# Altium schematic sheet schematic.SchDoc
size A4; SheetNumber: 1; SheetTotal: 1
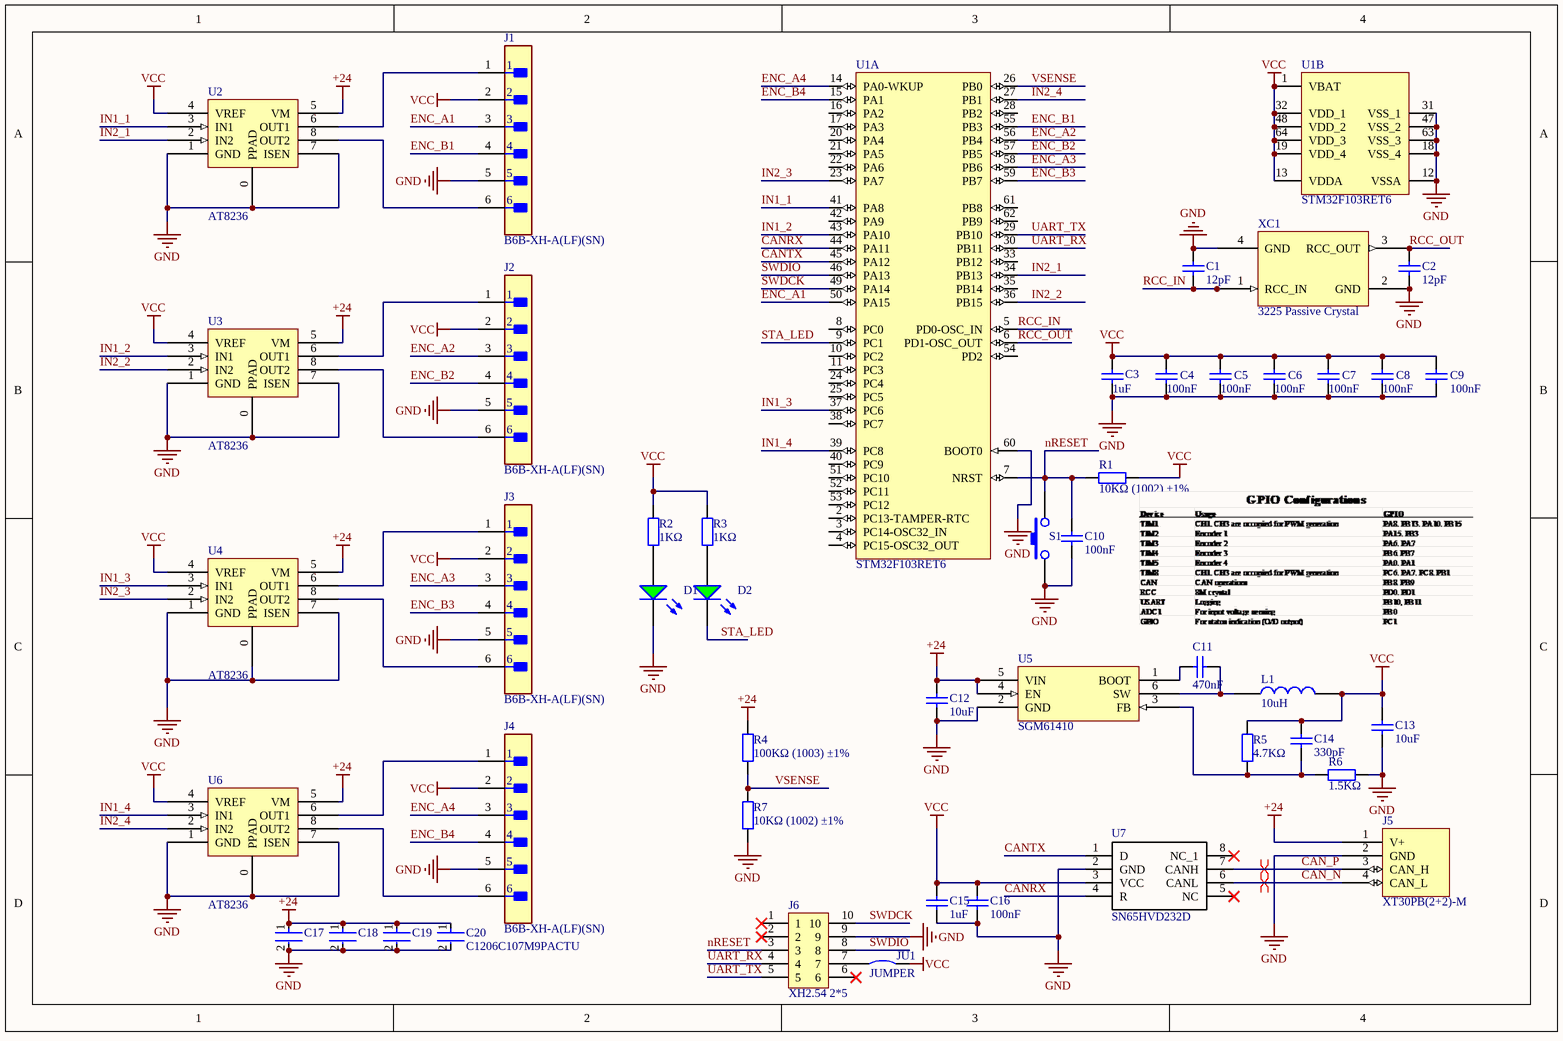
[diagram p0: schematic.SchDoc]

## Parts
C1  12pF  [0603_C]
C2  12pF  [0603_C]
C3  1uF  [0603_C]
C4  100nF  [0603_C]
C5  100nF  [0603_C]
C6  100nF  [0603_C]
C7  100nF  [0603_C]
C8  100nF  [0603_C]
C9  100nF  [0603_C]
C10  100nF  [0603_C]
C11  Capacitance: 470nF  [0603_C]  (hidden comment: 470nF (474) 10% 25V)
C12  10uF  [1206_C]
C13  10uF  [1206_C]
C14  330pF  [0603_C]
C15  1uF  [0603_C]
C16  100nF  [0603_C]
C17  C1206C107M9PACTU  [FP-C1206C-EH-MFG]  (value not drawn)
C18  C1206C107M9PACTU  [FP-C1206C-EH-MFG]  (value not drawn)
C19  C1206C107M9PACTU  [FP-C1206C-EH-MFG]  (value not drawn)
C20  C1206C107M9PACTU  [FP-C1206C-EH-MFG]
D1  绿灯 0603  [0603_LED_S1]  (value not drawn)
D2  绿灯 0603  [0603_LED_S1]  (value not drawn)
J1  B6B-XH-A(LF)(SN)  [FP-B6B-XH-A_LF_SN-MFG]
J2  B6B-XH-A(LF)(SN)  [FP-B6B-XH-A_LF_SN-MFG]
J3  B6B-XH-A(LF)(SN)  [FP-B6B-XH-A_LF_SN-MFG]
J4  B6B-XH-A(LF)(SN)  [FP-B6B-XH-A_LF_SN-MFG]
J5  XT30PB(2+2)-M  [XT30PB(2+2)-M-Footprint-1]
J6  XH2.54 2*5  [XH2.54-5x2]
JU1  JUMPER  [Jumper-2.54mm]
L1  10uH  [IND-2520X10N]
R1  10KΩ (1002) ±1%  [0603_R]
R2  1KΩ  [0603_R]
R3  1KΩ  [0603_R]
R4  100KΩ (1003) ±1%  [0603_R]
R5  4.7KΩ  [0603_R]
R6  1.5KΩ  [0603_R]
R7  10KΩ (1002) ±1%  [0603_R]
S1  按键  [SWT3*4]  (value not drawn)
U1  STM32F103RET6  [STM-LQFP64_V]  (parts A,B of 2)
U2  AT8236  [SOP-8_EP_150mil]
U3  AT8236  [SOP-8_EP_150mil]
U4  AT8236  [SOP-8_EP_150mil]
U5  SGM61410  [SOT23-6]
U6  AT8236  [SOP-8_EP_150mil]
U7  SN65HVD232D  [SOIC127P600X175-8N]
XC1  3225 Passive Crystal  [SMD-3225]

## Nets
+24: C12.2 C17.1 C18.1 C19.1 C20.1 J5.1(V+) R4.2 U2.5(VM) U3.5(VM) U4.5(VM) U5.4(EN) U5.5(VIN) U6.5(VM)
GND: C1.2 C2.1 C3.1 C4.1 C5.1 C6.1 C7.1 C8.1 C9.1 C10.1 C12.1 C13.1 C15.1 C16.1 C17.2 C18.2 C19.2 C20.2 D1.K J1.5 J2.5 J3.5 J4.5 J5.2(GND) J6.9 R6.1 R7.1 S1.1 U1.12(VSSA) U1.18(VSS_4) U1.31(VSS_1) U1.47(VSS_2) U1.60(BOOT0) U1.63(VSS_3) U2.0(PPAD) U2.1(GND) U2.7(ISEN) U3.0(PPAD) U3.1(GND) U3.7(ISEN) U4.0(PPAD) U4.1(GND) U4.7(ISEN) U5.2(GND) U6.0(PPAD) U6.1(GND) U6.7(ISEN) U7.2(GND) XC1.2(GND) XC1.4(GND)
VCC: C3.2 C4.2 C5.2 C6.2 C7.2 C8.2 C9.2 C13.2 C14.2 C15.2 C16.2 J1.2 J2.2 J3.2 J4.2 JU1.2 L1.2 R1.2 R2.2 R3.2 R5.2 U1.1(VBAT) U1.13(VDDA) U1.19(VDD_4) U1.32(VDD_1) U1.48(VDD_2) U1.64(VDD_3) U2.4(VREF) U3.4(VREF) U4.4(VREF) U6.4(VREF) U7.3(VCC)
CAN_N: J5.4(CAN_L) U7.6(CANL)
CAN_P: J5.3(CAN_H) U7.7(CANH)
CANRX: U1.44(PA11) U7.4(R)
CANTX: U1.45(PA12) U7.1(D)
ENC_A1: J1.3 U1.50(PA15)
ENC_A2: J2.3 U1.56(PB4)
ENC_A3: J3.3 U1.58(PB6)
ENC_A4: J4.3 U1.14(PA0-WKUP)
ENC_B1: J1.4 U1.55(PB3)
ENC_B2: J2.4 U1.57(PB5)
ENC_B3: J3.4 U1.59(PB7)
ENC_B4: J4.4 U1.15(PA1)
IN1_1: U1.41(PA8) U2.3(IN1)
IN1_2: U1.43(PA10) U3.3(IN1)
IN1_3: U1.37(PC6) U4.3(IN1)
IN1_4: U1.39(PC8) U6.3(IN1)
IN2_1: U1.34(PB13) U2.2(IN2)
IN2_2: U1.36(PB15) U3.2(IN2)
IN2_3: U1.23(PA7) U4.2(IN2)
IN2_4: U1.27(PB1) U6.2(IN2)
nRESET: C10.2 J6.3 R1.1 S1.2 U1.7(NRST)
RCC_IN: C1.1 U1.5(PD0-OSC_IN) XC1.1(RCC_IN)
RCC_OUT: C2.2 U1.6(PD1-OSC_OUT) XC1.3(RCC_OUT)
STA_LED: D2.K U1.9(PC1)
SWDCK: J6.10 U1.49(PA14)
SWDIO: J6.8 U1.46(PA13)
UART_RX: J6.4 U1.30(PB11)
UART_TX: J6.5 U1.29(PB10)
VSENSE: R4.1 R7.2 U1.26(PB0)
NetC11_1: C11.1 L1.1 U5.6(SW)
NetC11_2: C11.2 U5.1(BOOT)
NetC14_1: C14.1 R5.1 R6.2 U5.3(FB)
NetD1_A: D1.A R2.1
NetD2_A: D2.A R3.1
NetJ1_1: J1.1 U2.6(OUT1)
NetJ1_6: J1.6 U2.8(OUT2)
NetJ2_1: J2.1 U3.6(OUT1)
NetJ2_6: J2.6 U3.8(OUT2)
NetJ3_1: J3.1 U4.6(OUT1)
NetJ3_6: J3.6 U4.8(OUT2)
NetJ4_1: J4.1 U6.6(OUT1)
NetJ4_6: J4.6 U6.8(OUT2)
NetJ6_7: J6.7 JU1.1

Not connected (* = marked no-connect by the designer): J6 1* 2* 6*; U1 2(PC13-TAMPER-RTC) 3(PC14-OSC32_IN) 4(PC15-OSC32_OUT) 8(PC0) 10(PC2) 11(PC3) 16(PA2) 17(PA3) 20(PA4) 21(PA5) 22(PA6) 24(PC4) 25(PC5) 28(PB2) 33(PB12) 35(PB14) 38(PC7) 40(PC9) 42(PA9) 51(PC10) 52(PC11) 53(PC12) 54(PD2) 61(PB8) 62(PB9); U7 5(NC)* 8(NC_1)*

## Layout directives
differential pair: CAN_N, CAN_P

## Library data of the parts
C1 C2 = 0603 12pF (120) 5% 50V: 贴片电容; ComponentLink1Description: 供应商链接; ComponentLink1URL: http://www.szlcsc.com/product/details_39506.html; Package: 0603; Supplier: LC; SuppliersPartNumber: C38523
C3 C15 = 0603 1uF (105) 10% 50V: 贴片电容; ComponentLink1Description: 供应商链接; ComponentLink1URL: http://www.szlcsc.com/product/details_16531.html; Package: 0603; Supplier: LC; SuppliersPartNumber: C15849
C4-C10 C16 = 0603 100nF (104) 10% 50V: 贴片电容; ComponentLink1Description: 供应商链接; ComponentLink1URL: http://www.szlcsc.com/product/details_15331.html; Package: 0603; Supplier: LC; SuppliersPartNumber: C14663
C11 = 0603 470nF (474) 10% 25V: 贴片电容; ComponentLink1Description: 供应商链接; ComponentLink1URL: http://www.szlcsc.com/product/details_1975.html; Package: 0603; Supplier: LC; SuppliersPartNumber: C1623
C12 C13 = 1206 10uF (106) 10% 50V: 贴片电容; ComponentLink1Description: 供应商链接; ComponentLink1URL: http://www.szlcsc.com/product/details_14236.html; Package: 1206; Supplier: LC; SuppliersPartNumber: C13585
C14 = 0603 330pF (331) 5% 50V: 贴片电容; ComponentLink1Description: 供应商链接; ComponentLink1URL: http://www.szlcsc.com/product/details_2016.html; Package: 0603; Supplier: LC; SuppliersPartNumber: C1664
C17-C20 = CMP-1037-05005-3: CAP CER 100UF 6.3V X5R 1206; Dielectric Material: Ceramic; Tolerance: 2%; Dissipation Factor: 5%; Min Operating Temperature: -55°C; Case Code (Imperial): 1206; Case Code (Metric): 3216; Depth: 1.6mm; Dielectric: X5R; Max Operating Temperature: 85°C; Packaging: Tape and Reel; Construction: Flat; Series: C; Case/Package: 1206; Radiation Hardening: No; Voltage Rating (DC): 6.3V; Termination: SMD/SMT; Voltage Rating: 6.3V; Capacitance: 100uF; Number of Pins: 2; RoHS Compliant: Yes; Height: 1.6mm; Lead Free: Lead Free; Voltage: 6.3V; REACH SVHC: No SVHC; Length: 3.2mm; Mount: Surface Mount; Package Quantity: 1; Thickness: 0.071inch; Width: 0.063inch
D1 D2 = 0603 绿灯: 发光二极管; ComponentLink1Description: 供应商链接; ComponentLink1URL: http://www.szlcsc.com/product/details_73152.html; Package: 0603; Supplier: LC; SuppliersPartNumber: C72043
J1-J4 = CMP-17439-000076-1: CONN HEADER VERT 6POS 2.5MM
J5 = CMP-002-00072-5: This is a power connector that can also be used to send/receive can signals; Gender: Male; Pins: 4
JU1 = JUMPER: 跳线帽
L1 = IND: 电感
R1 R7 = 0603 10KΩ (1002) 1%: 贴片电阻; ComponentLink1Description: 供应商链接; ComponentLink1URL: http://www.szlcsc.com/product/details_26547.html; Package: 0603; Supplier: LC; SuppliersPartNumber: C25804
R2 R3 = 0603 1KΩ (1001) 1%: 贴片电阻; ComponentLink1Description: 供应商链接; ComponentLink1URL: http://www.szlcsc.com/product/details_21904.html; Package: 0603; Supplier: LC; SuppliersPartNumber: C21190
R4 = 0603 100KΩ (1003) 1%: 贴片电阻; ComponentLink1Description: 供应商链接; ComponentLink1URL: http://www.szlcsc.com/product/details_26546.html; Package: 0603; Supplier: LC; SuppliersPartNumber: C25803
R5 = 0603 4.7KΩ (4701) 1%: 贴片电阻; ComponentLink1Description: 供应商链接; ComponentLink1URL: http://www.szlcsc.com/product/details_23889.html; Package: 0603; Supplier: LC; SuppliersPartNumber: C23162
R6 = 0603 1.5KΩ (1501) 1%: 贴片电阻; ComponentLink1Description: 供应商链接; ComponentLink1URL: http://www.szlcsc.com/product/details_23570.html; Package: 0603; Supplier: LC; SuppliersPartNumber: C22843
S1 = Button
U1 = CMP-0237-00201-3: ARM Cortex-M3 32-bit MCU, 512 KB Flash, 64 KB Internal RAM, 51 I/Os, 64-pin LQFP, -40 to 85 degC, Tray; FLASH Size (Prog) (kB): 512; Internal RAM Size (kB): 64; A/D Converter: 3x12-bit (16 Channel); I/Os (High Current): 51; Supply Voltage(Vcc) min (V): 2; D/A Converter: 2x12-bit (2 Channel); Operating Frequency(F) (Processor speed) (MHz): 72; PackageDescription: 64-Pin Low Profile Quad Flat Package, 10 x 10 mm Body, 0.5 mm Pitch; ComponentLink3URL: http://www.st.com/st-web-ui/static/active/en/resource/technical/document/datasheet/DM00037051.pdf; DatasheetVersion: Rev. 8; Packing: Tray; PackageReference: LQFP64; ComponentLink3Description: Package Specification; Core: ARM Cortex-M3; Mounting Technology: Surface Mount; PartNumber: STM32F103RET6; PackageVersion: Rev. 4, 06/2013; ComponentLink1URL: http://www.st.com/web/en/home.html; ComponentLink1Description: Manufacturer URL; ComponentLink2Description: Datasheet; ComponentLink2URL: http://www.st.com/st-web-ui/static/active/en/resource/technical/document/datasheet/CD00191185.pdf
U2-U4 U6 = AT8236: Single Channel, DC, Brush motor driving IC
U5 = SGM61410XN6G: 1.2MHz, 600mA, 42V Synchronous Buck Converter; ComponentLink1Description: Manufacturer Homepage; ComponentLink1URL: https://www.sg-micro.com/cn/product/SGM61410
U7 = SN65HVD232D: 3.3-V CAN TRANSCEIVER; Manufacturer_Name: Texas Instruments; Datasheet Link: http://www.ti.com/lit/ds/symlink/sn65hvd232.pdf; Height: 1.75mm; Manufacturer_Part_Number: SN65HVD232D; Mouser Part Number: 595-SN65HVD232D; Mouser Price/Stock: https://www.mouser.com/Search/Refine.aspx?Keyword=595-SN65HVD232D; RS Part Number: 1977506; RS Price/Stock: http://uk.rs-online.com/web/p/products/1977506